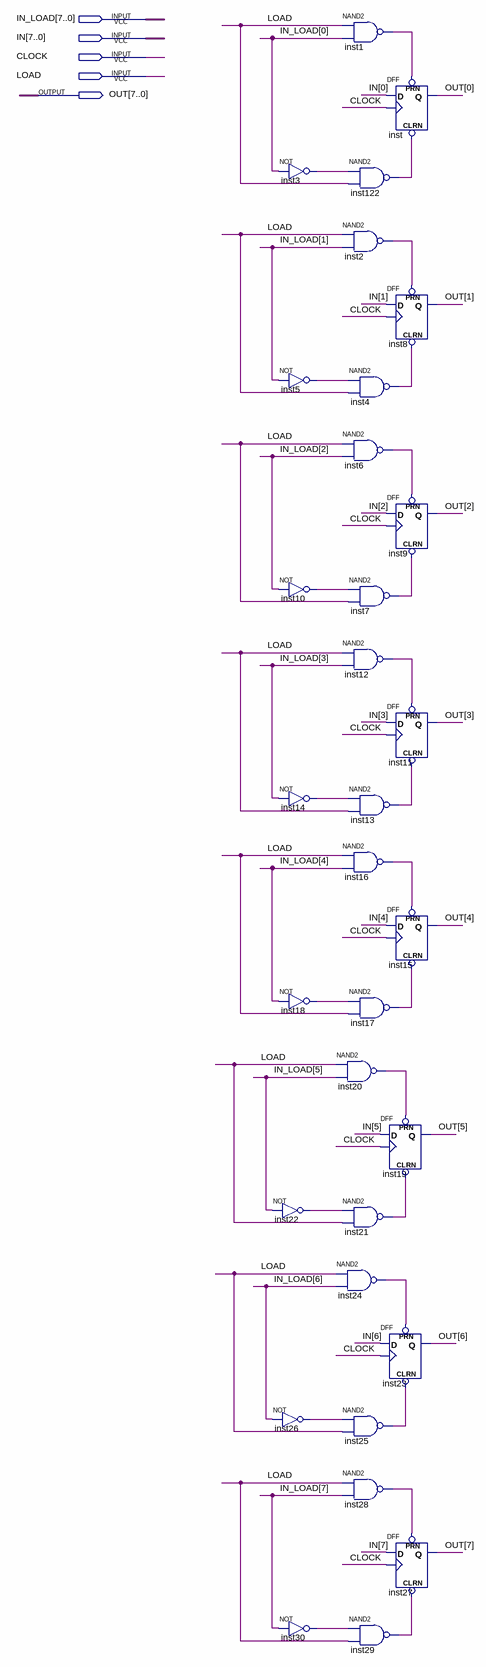
[diagram p0: schematic sheet]
// Quartus schematic REGISTER_8bit.bdf as structural Verilog: 32 symbols, 5 pins
module REGISTER_8bit (
  input  [7:0] IN_LOAD,
  input  [7:0] IN,
  input  CLOCK,
  input  LOAD,
  output [7:0] OUT
);

  wire inst1_out, inst2_out, inst3_out, inst4_out, inst5_out, inst6_out, inst7_out, inst10_out, inst12_out,
       inst13_out, inst14_out, inst16_out, inst17_out, inst18_out, inst20_out, inst21_out, inst22_out,
       inst24_out, inst25_out, inst26_out, inst28_out, inst29_out, inst30_out, inst122_out;

  not inst3 (inst3_out, IN_LOAD[0]);
  not inst5 (inst5_out, IN_LOAD[1]);
  not inst10 (inst10_out, IN_LOAD[2]);
  not inst14 (inst14_out, IN_LOAD[3]);
  not inst18 (inst18_out, IN_LOAD[4]);
  not inst22 (inst22_out, IN_LOAD[5]);
  not inst26 (inst26_out, IN_LOAD[6]);
  not inst30 (inst30_out, IN_LOAD[7]);
  nand inst1 (inst1_out, LOAD, IN_LOAD[0]);
  nand inst122 (inst122_out, inst3_out, LOAD);
  nand inst2 (inst2_out, LOAD, IN_LOAD[1]);
  nand inst4 (inst4_out, inst5_out, LOAD);
  nand inst6 (inst6_out, LOAD, IN_LOAD[2]);
  nand inst7 (inst7_out, inst10_out, LOAD);
  nand inst12 (inst12_out, LOAD, IN_LOAD[3]);
  nand inst13 (inst13_out, inst14_out, LOAD);
  nand inst16 (inst16_out, LOAD, IN_LOAD[4]);
  nand inst17 (inst17_out, inst18_out, LOAD);
  nand inst20 (inst20_out, LOAD, IN_LOAD[5]);
  DFF inst19 (.CLRN(inst21_out), .CLK(CLOCK), .D(IN[5]), .PRN(inst20_out), .Q(OUT[5]));
  nand inst21 (inst21_out, inst22_out, LOAD);
  nand inst24 (inst24_out, LOAD, IN_LOAD[6]);
  DFF inst23 (.CLRN(inst25_out), .CLK(CLOCK), .D(IN[6]), .PRN(inst24_out), .Q(OUT[6]));
  nand inst25 (inst25_out, inst26_out, LOAD);
  nand inst28 (inst28_out, LOAD, IN_LOAD[7]);
  nand inst29 (inst29_out, inst30_out, LOAD);
  DFF inst (.CLRN(inst122_out), .CLK(CLOCK), .D(IN[0]), .PRN(inst1_out), .Q(OUT[0]));
  DFF inst8 (.CLRN(inst4_out), .CLK(CLOCK), .D(IN[1]), .PRN(inst2_out), .Q(OUT[1]));
  DFF inst9 (.CLRN(inst7_out), .CLK(CLOCK), .D(IN[2]), .PRN(inst6_out), .Q(OUT[2]));
  DFF inst11 (.CLRN(inst13_out), .CLK(CLOCK), .D(IN[3]), .PRN(inst12_out), .Q(OUT[3]));
  DFF inst15 (.CLRN(inst17_out), .CLK(CLOCK), .D(IN[4]), .PRN(inst16_out), .Q(OUT[4]));
  DFF inst27 (.CLRN(inst29_out), .CLK(CLOCK), .D(IN[7]), .PRN(inst28_out), .Q(OUT[7]));
endmodule
